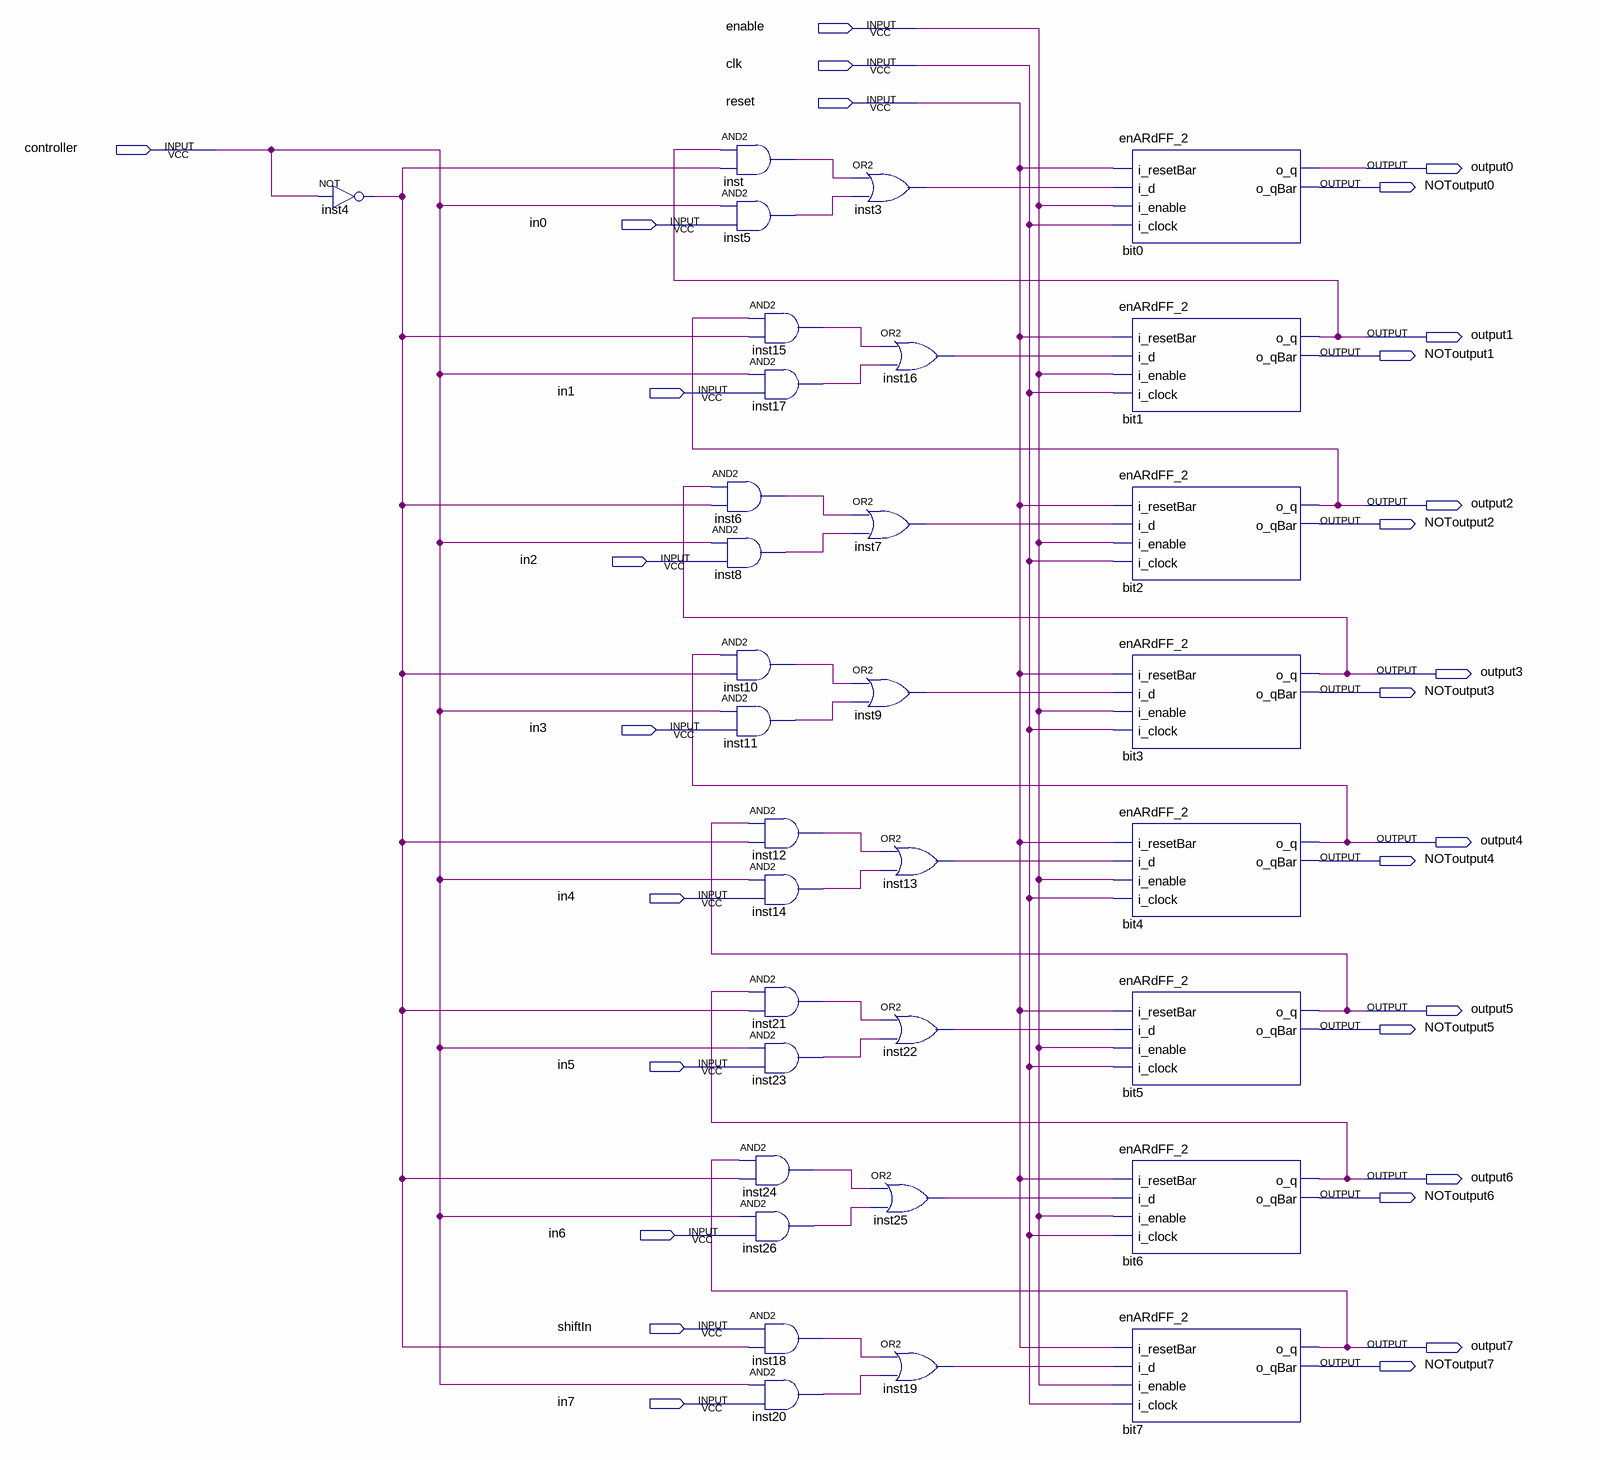
[diagram p0: schematic sheet]
// Quartus schematic lab1.bdf as structural Verilog: 33 symbols, 29 pins
module lab1 (
  input  enable,
  input  clk,
  input  reset,
  input  controller,
  input  in0,
  input  in1,
  input  in2,
  input  in3,
  input  in4,
  input  in5,
  input  in6,
  input  shiftIn,
  input  in7,
  output output0,
  output NOToutput0,
  output output1,
  output NOToutput1,
  output output2,
  output NOToutput2,
  output output3,
  output NOToutput3,
  output output4,
  output NOToutput4,
  output output5,
  output NOToutput5,
  output output6,
  output NOToutput6,
  output output7,
  output NOToutput7
);

  wire inst3_out, inst4_out, inst5_out, inst6_out, inst7_out, inst8_out, inst9_out, inst10_out, inst11_out,
       inst12_out, inst13_out, inst14_out, inst15_out, inst16_out, inst17_out, inst18_out, inst19_out,
       inst20_out, inst21_out, inst22_out, inst23_out, inst24_out, inst25_out, inst26_out, inst_out;

  not inst4 (inst4_out, controller);
  and inst (inst_out, output1, inst4_out);
  and inst5 (inst5_out, controller, in0);
  and inst15 (inst15_out, output2, inst4_out);
  and inst17 (inst17_out, controller, in1);
  and inst6 (inst6_out, output3, inst4_out);
  and inst8 (inst8_out, controller, in2);
  and inst10 (inst10_out, output4, inst4_out);
  and inst11 (inst11_out, controller, in3);
  and inst12 (inst12_out, output5, inst4_out);
  and inst14 (inst14_out, controller, in4);
  and inst21 (inst21_out, output6, inst4_out);
  and inst23 (inst23_out, controller, in5);
  and inst24 (inst24_out, output7, inst4_out);
  and inst26 (inst26_out, controller, in6);
  and inst18 (inst18_out, shiftIn, inst4_out);
  and inst20 (inst20_out, controller, in7);
  or inst3 (inst3_out, inst_out, inst5_out);
  or inst16 (inst16_out, inst15_out, inst17_out);
  or inst7 (inst7_out, inst6_out, inst8_out);
  or inst9 (inst9_out, inst10_out, inst11_out);
  or inst13 (inst13_out, inst12_out, inst14_out);
  or inst22 (inst22_out, inst21_out, inst23_out);
  or inst25 (inst25_out, inst24_out, inst26_out);
  or inst19 (inst19_out, inst18_out, inst20_out);
  enARdFF_2 bit0 (
    .i_resetBar(reset), .i_d(inst3_out), .i_enable(enable), .i_clock(clk), .o_q(output0), .o_qBar(NOToutput0));
  enARdFF_2 bit1 (
    .i_resetBar(reset), .i_d(inst16_out), .i_enable(enable), .i_clock(clk), .o_q(output1), .o_qBar(NOToutput1));
  enARdFF_2 bit2 (
    .i_resetBar(reset), .i_d(inst7_out), .i_enable(enable), .i_clock(clk), .o_q(output2), .o_qBar(NOToutput2));
  enARdFF_2 bit3 (
    .i_resetBar(reset), .i_d(inst9_out), .i_enable(enable), .i_clock(clk), .o_q(output3), .o_qBar(NOToutput3));
  enARdFF_2 bit4 (
    .i_resetBar(reset), .i_d(inst13_out), .i_enable(enable), .i_clock(clk), .o_q(output4), .o_qBar(NOToutput4));
  enARdFF_2 bit5 (
    .i_resetBar(reset), .i_d(inst22_out), .i_enable(enable), .i_clock(clk), .o_q(output5), .o_qBar(NOToutput5));
  enARdFF_2 bit6 (
    .i_resetBar(reset), .i_d(inst25_out), .i_enable(enable), .i_clock(clk), .o_q(output6), .o_qBar(NOToutput6));
  enARdFF_2 bit7 (
    .i_resetBar(reset), .i_d(inst19_out), .i_enable(enable), .i_clock(clk), .o_q(output7), .o_qBar(NOToutput7));
endmodule
